# EAGLE design fixture_auto (EAGLE 7.6.0)
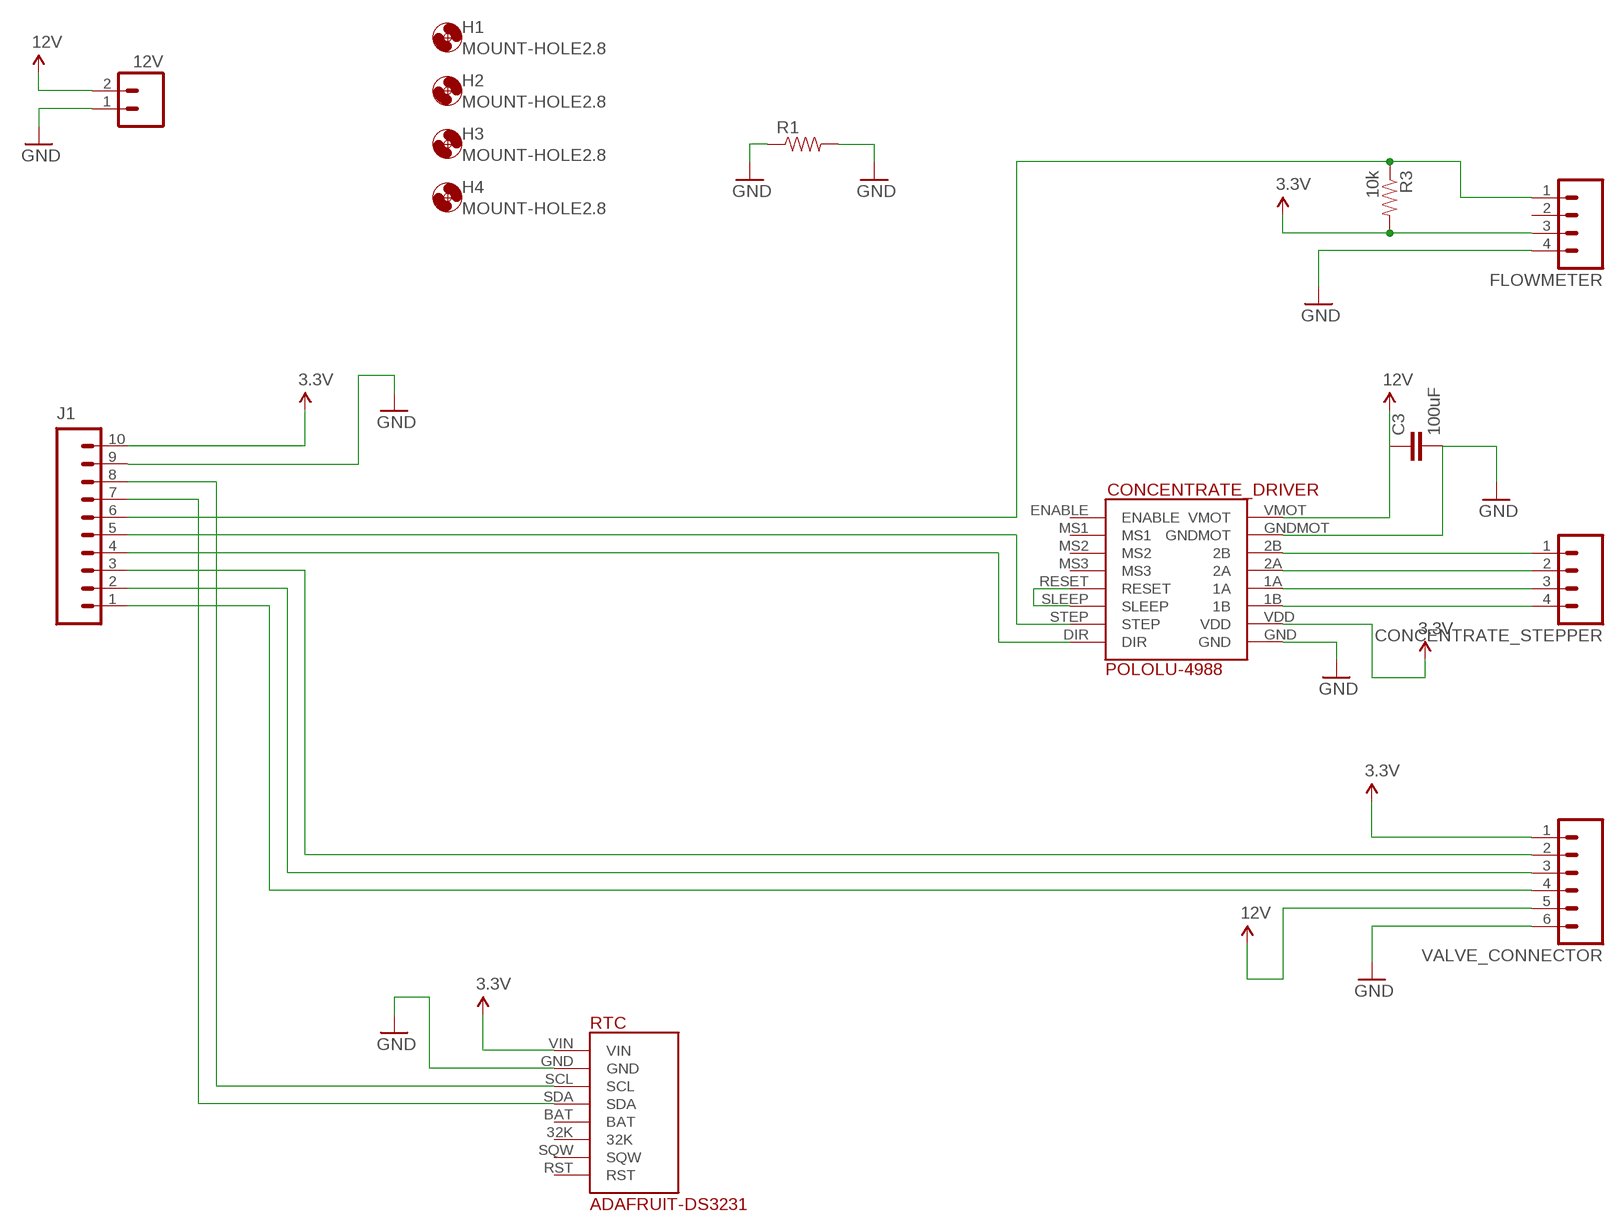
[diagram p0: schematic, sheet 1]

## Parts
12V  M02LOCK_LONGPADS  [1X02_LOCK_LONGPADS]
C3  100uF  0.1UF-50V-20%(PTH)KIT-EZ  [CAP-PTH-SMALL-KIT]
CONCENTRATE_DRIVER  POLOLU-4988  [POLOLU-4988]
CONCENTRATE_STEPPER  M04LOCK_LONGPADS  [1X04_LOCK_LONGPADS]
FLOWMETER  M04LOCK_LONGPADS  [1X04_LOCK_LONGPADS]
H1  MOUNT-HOLE2.8  [2,8]
H2  MOUNT-HOLE2.8  [2,8]
H3  MOUNT-HOLE2.8  [2,8]
H4  MOUNT-HOLE2.8  [2,8]
J1  M10LOCK_LONGPADS  [1X10_LOCK_LONGPADS]
R1  RESISTORPTH-1/2W  [AXIAL-0.5]
R3  10k  RESISTOREZ  [AXIAL-0.3EZ]
RTC  ADAFRUIT-DS3231  [ADAFRUIT-DS3231]
VALVE_CONNECTOR  M06LOCK_LONGPADS  [1X06_LOCK_LONGPADS]

## Nets
3.3V: CONCENTRATE_DRIVER.VDD FLOWMETER.3 J1.10 R3.P$2 RTC.VIN VALVE_CONNECTOR.1
12V: 12V.2 C3.1 CONCENTRATE_DRIVER.VMOT VALVE_CONNECTOR.5
FLOW_PULSE: FLOWMETER.1 J1.6 R3.P$1
GND: 12V.1 C3.2 CONCENTRATE_DRIVER.GND CONCENTRATE_DRIVER.GNDMOT FLOWMETER.4 J1.9 R1.P$1 R1.P$2 RTC.GND VALVE_CONNECTOR.6
N$1: J1.3 VALVE_CONNECTOR.2
N$2: J1.2 VALVE_CONNECTOR.3
N$3: CONCENTRATE_DRIVER.2B CONCENTRATE_STEPPER.1
N$4: J1.1 VALVE_CONNECTOR.4
N$7: CONCENTRATE_DRIVER.2A CONCENTRATE_STEPPER.2
N$8: CONCENTRATE_DRIVER.1A CONCENTRATE_STEPPER.3
N$9: CONCENTRATE_DRIVER.1B CONCENTRATE_STEPPER.4
N$10: CONCENTRATE_DRIVER.RESET CONCENTRATE_DRIVER.SLEEP
N$11: CONCENTRATE_DRIVER.STEP J1.5
N$12: CONCENTRATE_DRIVER.DIR J1.4
N$15: J1.8 RTC.SCL
N$16: J1.7 RTC.SDA
Unconnected: CONCENTRATE_DRIVER.ENABLE CONCENTRATE_DRIVER.MS1 CONCENTRATE_DRIVER.MS2 CONCENTRATE_DRIVER.MS3 FLOWMETER.2 RTC.32K RTC.BAT RTC.RST RTC.SQW

## Library data of the parts
12V = SparkFun-Connectors:M02: Standard 2-pin 0.1" header. Use with - straight break away headers ( PRT-00116) - right angle break away headers (PRT-00553) - swiss pins (PRT-00743) - machine pins (PRT-00117) - female headers (PRT-00115) Molex polarized connector foot print use with: PRT-08233 with associated crimp pins and housings. 2.54_SCREWTERM for use with PRT-10571. 3.5mm Screw Terminal footprints for PRT-08084 5mm Screw Terminal footprints for use with PRT-08432
C3 = SparkFun-Capacitors:0.1UF-50V-20%(PTH): CAP-08370; PROD_ID: CAP-08370
CONCENTRATE_DRIVER = dotson:POLOLU-4988: Pololu 4988 stepper motor driver footprint
CONCENTRATE_STEPPER FLOWMETER = SparkFun-Connectors:M04: Header 4 Standard 4-pin 0.1" header. Use with straight break away headers (SKU : PRT-00116), right angle break away headers (PRT-00553), swiss pins (PRT-00743), machine pins (PRT-00117), and female headers (PRT-00115). Molex polarized connector foot print use with SKU : PRT-08231 with associated crimp pins and housings. 1MM SMD Version SKU: PRT-10208; PROD_ID: CONN-09696
H1-H4 = holes:MOUNT-HOLE: MOUNTING HOLE with drill center marker
J1 = SparkFun-Connectors:M10: Header 10 Standard 10-pin 0.1" header. Use with straight break away headers (SKU : PRT-00116), right angle break away headers (PRT-00553), swiss pins (PRT-00743), machine pins (PRT-00117), and female headers (PRT-00115).
R1 = SparkFun-Resistors:RESISTOR: Resistor Basic schematic elements and footprints for 0603, 1206, and PTH resistors.
R3 = SparkFun-Passives:RESISTOR: Resistor Basic schematic elements and footprints for 0603, 1206, and PTH resistors.
RTC = dotson:ADAFRUIT-DS3231
VALVE_CONNECTOR = SparkFun-Connectors:M06: Header 6 Standard 6-pin 0.1" header. Use with straight break away headers (SKU : PRT-00116), right angle break away headers (PRT-00553), swiss pins (PRT-00743), machine pins (PRT-00117), and female headers (PRT-00115). Molex polarized connector foot print use with SKU : PRT-08094 with associated crimp pins and housings. NOTES ON THE VARIANTS LOCK and LOCK_LONGPADS... This footprint was designed to help hold the alignment of a through-hole component (i.e. 6-pin header) while soldering it into place. You may notice that each hole has been shifted either up or down by 0.005 of an inch from it's more standard position (which is a perfectly straight line). This slight alteration caused the pins (the squares in the middle) to touch the edges of the holes. Because they are alternating, it causes a "brace" to hold the component in place. 0.005 has proven to be the perfect amount of "off-center" position when using our standard breakaway headers. Although looks a little odd when you look at the bare footprint, once you have a header in there, the alteration is very hard to notice. Also,if you push a header all the way into place, it is covered up entirely on the bottom side. This idea of altering the position of holes to aid alignment will be further integrated into the Sparkfun Library for other footprints. It can help hold any component with 3 or more connection pins.

## Board
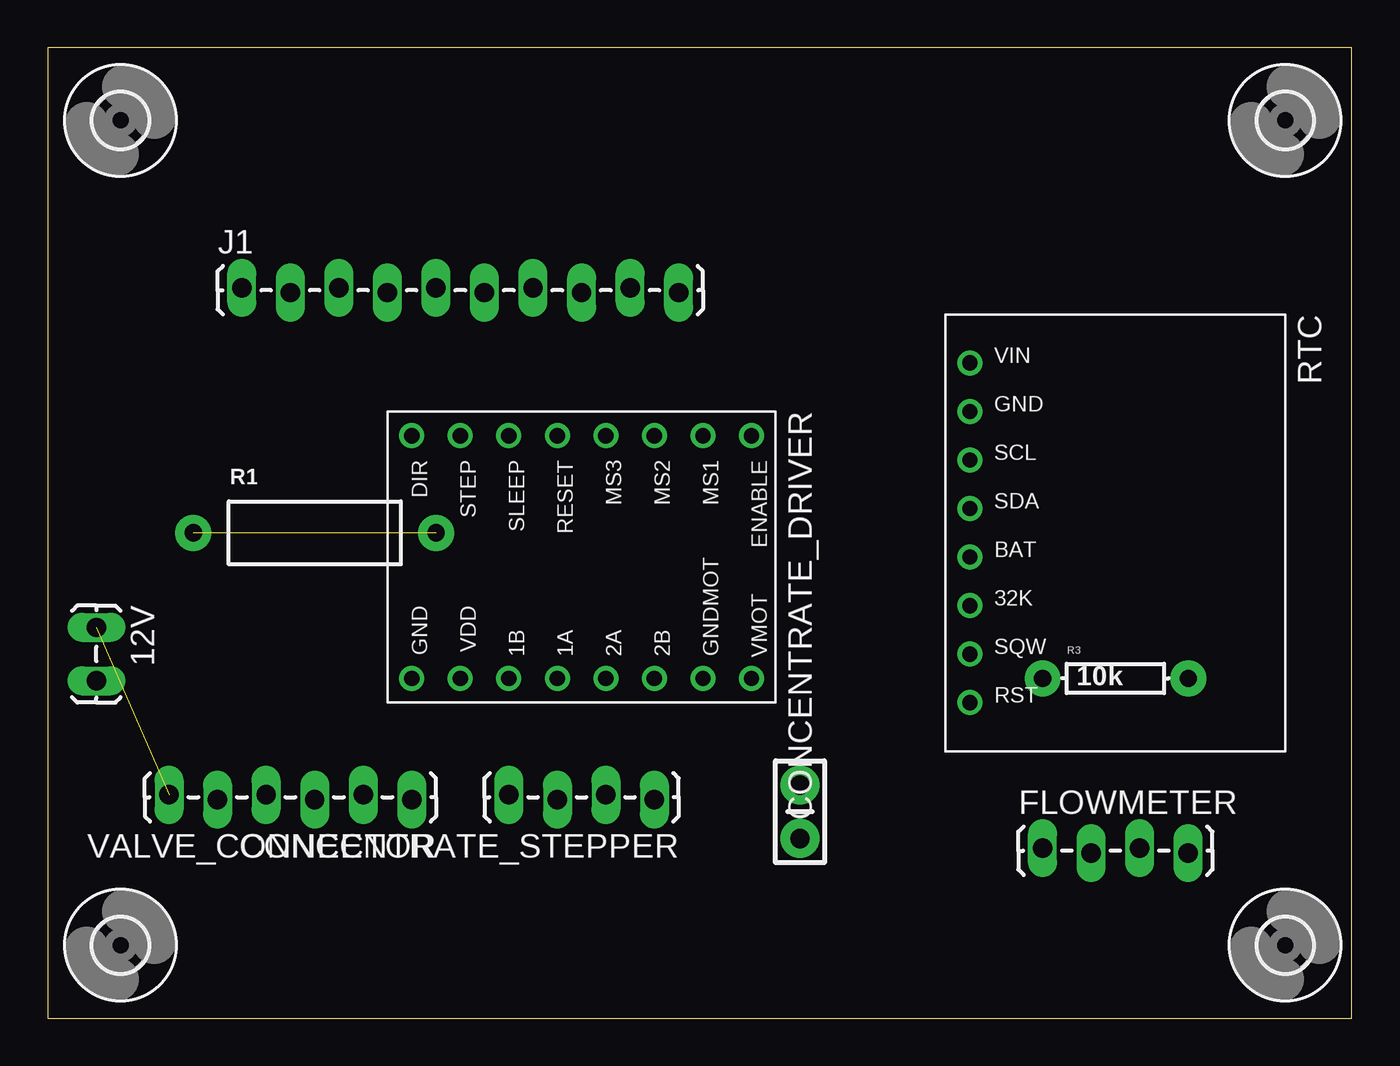
[diagram p1: board, top side]
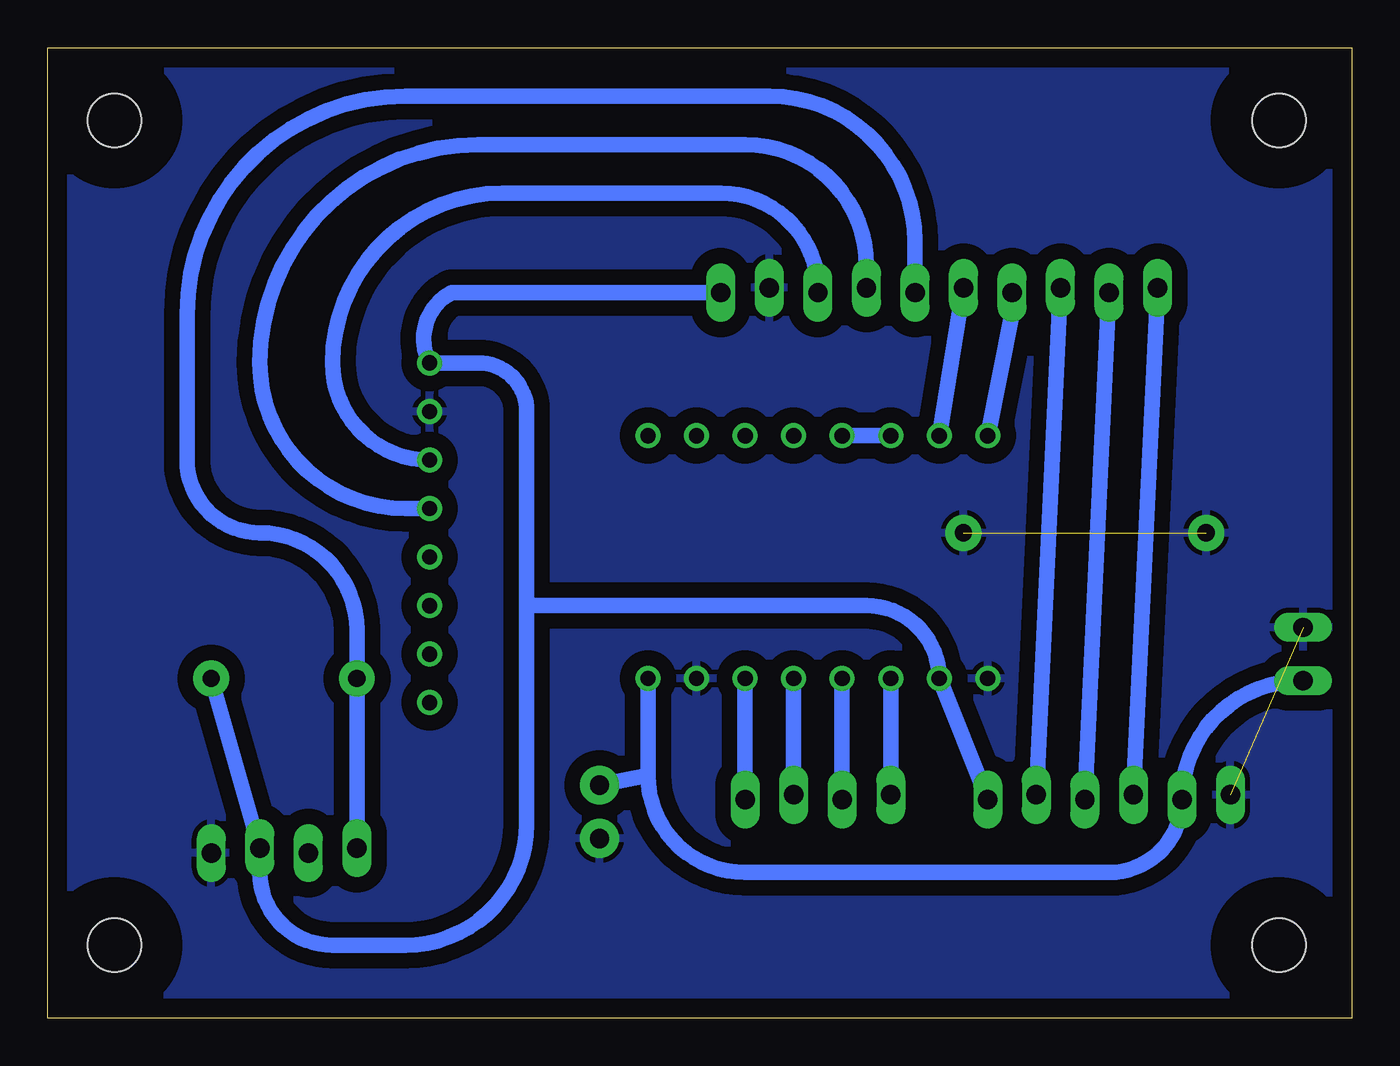
[diagram p2: board, bottom side, seen from below]

Size 68.25 x 50.79 mm. Coordinates in mm from the lower left corner, seen from the top.
Outline: 0,0 68.25,0 68.25,50.79 0,50.79 0,0
Copper layers (1*16): Top 0.035mm / dielectric 1.5mm / Bottom 0.035mm
Design rules "default *": minimum track width 31mil, minimum drill 24mil, track to track 32mil, track to pad 32mil, pad to pad 32mil, via to via 32mil, smd to smd 8mil, copper to edge 40mil, drill to drill 31mil, minimum pad ring 10mil, minimum via ring 8mil, stop-mask expansion 4mil, vias tented up to drill 0mil, thermal gap 10mil

### Footprints (pad centres in the part's own frame; a part is rotated, then mirrored left to right if it is on the bottom)
1X02_LOCK_LONGPADS = drill 1.016 long: 1 -0.127,0; 2 2.667,0
CAP-PTH-SMALL-KIT = drill 1.016 pad 2.032: 1 -1.397,0; 2 1.397,0
POLOLU-4988 = drill 0.8: 1A 13.97,8.89; 1B 13.97,6.35; 2A 13.97,11.43; 2B 13.97,13.97; DIR 1.27,1.27; ENABLE 1.27,19.05; GND 13.97,1.27; GNDMOT 13.97,16.51; MS1 1.27,16.51; MS2 1.27,13.97; MS3 1.27,11.43; RESET 1.27,8.89; SLEEP 1.27,6.35; STEP 1.27,3.81; VDD 13.97,3.81; VMOT 13.97,19.05
1X04_LOCK_LONGPADS = drill 1.016 long: 1 0,0; 2 2.54,-0.254; 3 5.08,0; 4 7.62,-0.254
2,8 = hole 2.8: 0,0
1X10_LOCK_LONGPADS = drill 1.016 long: 1 0,0.127; 2 2.54,-0.127; 3 5.08,0.127; 4 7.62,-0.127; 5 10.16,0.127; 6 12.7,-0.127; 7 15.24,0.127; 8 17.78,-0.127; 9 20.32,0.127; 10 22.86,-0.127
AXIAL-0.5 = drill 0.9 pad 1.88: P$1 -6.35,0; P$2 6.35,0
AXIAL-0.3EZ = drill 0.9 pad 1.88: P$1 -3.81,0; P$2 3.81,0
ADAFRUIT-DS3231 = drill 0.8: 32K 15.24,1.27; BAT 12.7,1.27; GND 5.08,1.27; RST 20.32,1.27; SCL 7.62,1.27; SDA 10.16,1.27; SQW 17.78,1.27; VIN 2.54,1.27
1X06_LOCK_LONGPADS = drill 1.016 long: 1 0,0; 2 2.54,-0.254; 3 5.08,0; 4 7.62,-0.254; 5 10.16,0; 6 12.7,-0.254

### Placement (x,y rotation side)
12V  2.54,20.32 270 top
C3  39.37,10.8 270 top
CONCENTRATE_DRIVER  17.78,31.75 270 top
CONCENTRATE_STEPPER  31.75,11.43 180 top
FLOWMETER  52.07,8.89 0 top
H1  64.77,46.99 0 top
H2  64.77,3.81 0 top
H3  3.81,3.81 0 top
H4  3.81,46.99 0 top
J1  10.16,38.1 0 top
R1  13.97,25.4 0 top
R3  55.88,17.78 0 top
RTC  46.99,36.83 270 top
VALVE_CONNECTOR  19.05,11.43 180 top

### Tracks (layer width: path | path; a pad name or v marks a point on that pad's centre or on a via)
3.3V
  Bottom 0.813: J1.10 47.12,37.97 arc-90 RTC.VIN 45.72,34.29 arc90 43.18,31.75 43.18,21.59 | 43.18,21.59 43.18,10.16 arc90 49.53,3.81 53.34,3.81 arc90 57.15,7.62 FLOWMETER.3 R3.P$2 | 43.18,21.59 25.4,21.59 arc90 CONCENTRATE_DRIVER.VDD VALVE_CONNECTOR.1
12V
  Bottom 0.813: 36.83,12.7 arc-90 31.75,7.62 12.7,7.62 arc-90 VALVE_CONNECTOR.5 arc90 2.67,17.65 12V.2 | 36.83,12.7 CONCENTRATE_DRIVER.VMOT | C3.1 36.83,12.7
FLOW_PULSE
  Bottom 0.813: FLOWMETER.1 R3.P$1 52.07,20.32 arc-90 57.15,25.4 arc90 60.96,29.21 60.96,36.83 arc90 49.53,48.26 30.48,48.26 arc90 22.86,40.64 J1.6
GND  (2 unrouted)
  pour Bottom: 0,50.8 68.58,50.8 68.58,0 0,0
N$1
  Bottom 0.813: J1.3 VALVE_CONNECTOR.2
N$2
  Bottom 0.813: J1.2 VALVE_CONNECTOR.3
N$3
  Bottom 0.813: CONCENTRATE_DRIVER.2B CONCENTRATE_STEPPER.1
N$4
  Bottom 0.813: J1.1 VALVE_CONNECTOR.4
N$7
  Bottom 0.813: CONCENTRATE_DRIVER.2A CONCENTRATE_STEPPER.2
N$8
  Bottom 0.813: CONCENTRATE_DRIVER.1A CONCENTRATE_STEPPER.3
N$9
  Bottom 0.813: CONCENTRATE_DRIVER.1B CONCENTRATE_STEPPER.4
N$10
  Bottom 0.813: CONCENTRATE_DRIVER.SLEEP CONCENTRATE_DRIVER.RESET
N$11
  Bottom 0.813: CONCENTRATE_DRIVER.STEP J1.5
N$12
  Bottom 0.813: CONCENTRATE_DRIVER.DIR 17.78,36.83 J1.4
N$15
  Bottom 0.813: J1.8 27.94,38.1 arc-90 33.02,43.18 44.45,43.18 arc-90 53.34,34.29 arc-90 RTC.SCL
N$16
  Bottom 0.813: J1.7 25.4,39.37 arc-90 31.75,45.72 45.72,45.72 arc-90 57.15,34.29 arc-90 49.53,26.67 RTC.SDA